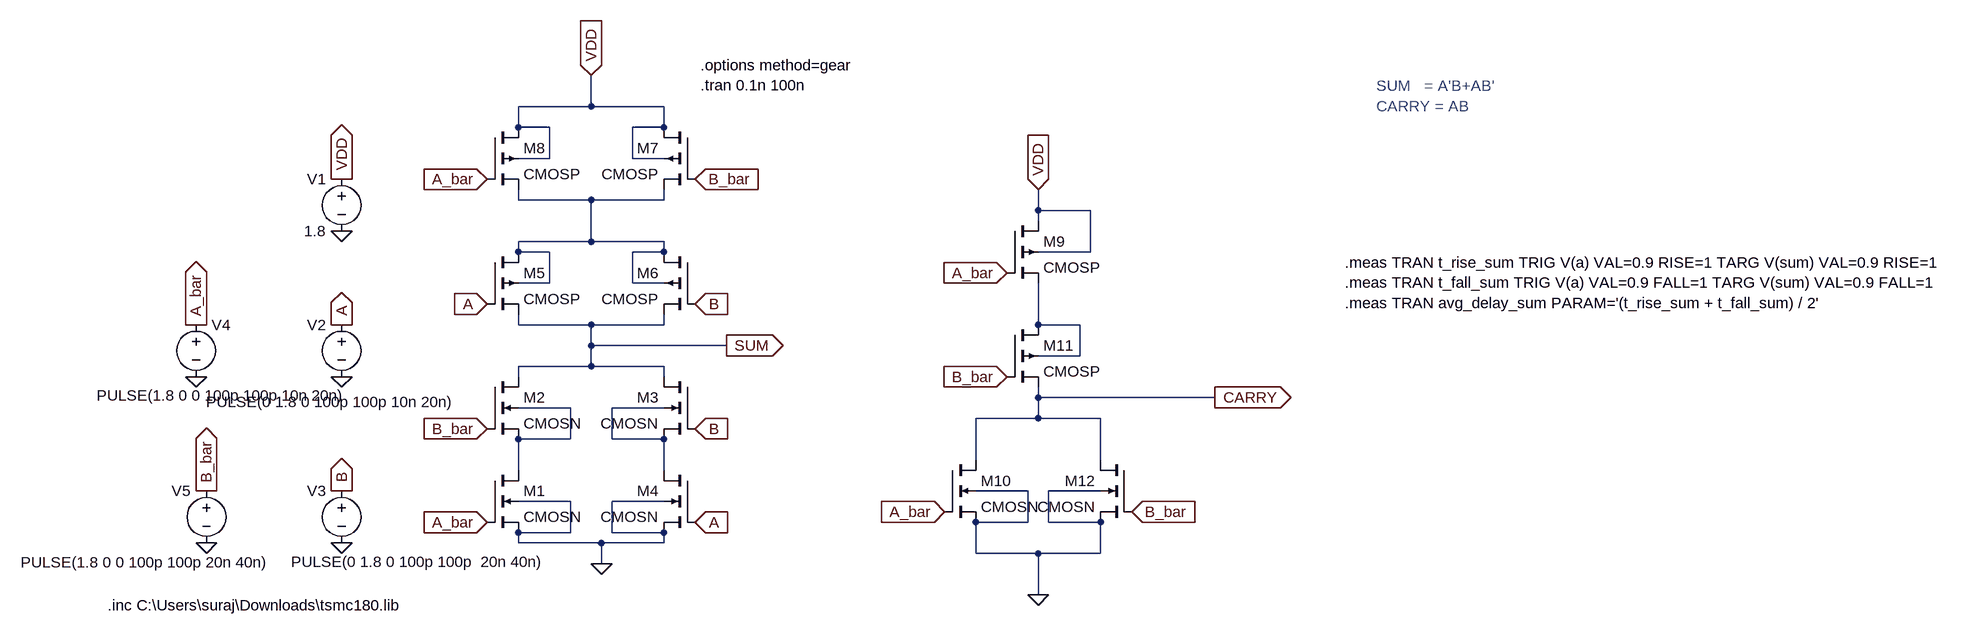
[diagram p0: schematic CMOS_haldAdder.asc]
CMOS_haldAdder.asc, the LTspice schematic file:
Version 4
SHEET 1 1704 712
WIRE -192 -96 -192 -144
WIRE -192 -96 -304 -96
WIRE -80 -96 -192 -96
WIRE -304 -64 -304 -96
WIRE -256 -64 -304 -64
WIRE -80 -64 -80 -96
WIRE -80 -64 -128 -64
WIRE -256 -16 -256 -64
WIRE -256 -16 -304 -16
WIRE -128 -16 -128 -64
WIRE -80 -16 -128 -16
WIRE -304 48 -304 32
WIRE -192 48 -304 48
WIRE -80 48 -80 32
WIRE -80 48 -192 48
WIRE 496 64 496 32
WIRE 576 64 496 64
WIRE 496 80 496 64
WIRE -192 112 -192 48
WIRE -192 112 -304 112
WIRE -80 112 -192 112
WIRE -304 128 -304 112
WIRE -256 128 -304 128
WIRE -80 128 -80 112
WIRE -80 128 -128 128
WIRE 576 128 576 64
WIRE 576 128 496 128
WIRE -256 176 -256 128
WIRE -256 176 -304 176
WIRE -128 176 -128 128
WIRE -80 176 -128 176
WIRE -304 240 -304 224
WIRE -192 240 -304 240
WIRE -80 240 -80 224
WIRE -80 240 -192 240
WIRE 496 240 496 176
WIRE 560 240 496 240
WIRE -192 272 -192 240
WIRE 16 272 -192 272
WIRE 560 288 560 240
WIRE 560 288 496 288
WIRE -192 304 -192 272
WIRE -192 304 -304 304
WIRE -80 304 -192 304
WIRE -304 320 -304 304
WIRE -80 320 -80 304
WIRE 496 352 496 336
WIRE 768 352 496 352
WIRE -224 368 -304 368
WIRE -80 368 -160 368
WIRE 496 384 496 352
WIRE 496 384 400 384
WIRE 592 384 496 384
WIRE -224 416 -224 368
WIRE -224 416 -304 416
WIRE -160 416 -160 368
WIRE -80 416 -160 416
WIRE 400 448 400 384
WIRE 592 448 592 384
WIRE -304 464 -304 416
WIRE -80 464 -80 416
WIRE 480 496 400 496
WIRE 592 496 512 496
WIRE -224 512 -304 512
WIRE -80 512 -160 512
WIRE 480 544 480 496
WIRE 480 544 400 544
WIRE 512 544 512 496
WIRE 592 544 512 544
WIRE -224 560 -224 512
WIRE -224 560 -304 560
WIRE -160 560 -160 512
WIRE -80 560 -160 560
WIRE -304 576 -304 560
WIRE -176 576 -304 576
WIRE -80 576 -80 560
WIRE -80 576 -176 576
WIRE 400 592 400 544
WIRE 496 592 400 592
WIRE 592 592 592 544
WIRE 592 592 496 592
WIRE -176 608 -176 576
WIRE 496 656 496 592
FLAG -176 608 0
FLAG -352 400 B_bar
IOPIN -352 400 In
FLAG -352 544 A_bar
IOPIN -352 544 In
FLAG -32 400 B
IOPIN -32 400 In
FLAG -32 544 A
IOPIN -32 544 In
FLAG -352 208 A
IOPIN -352 208 In
FLAG -352 16 A_bar
IOPIN -352 16 In
FLAG -32 16 B_bar
IOPIN -32 16 In
FLAG -32 208 B
IOPIN -32 208 In
FLAG 16 272 SUM
IOPIN 16 272 Out
FLAG -192 -144 VDD
IOPIN -192 -144 In
FLAG 448 160 A_bar
IOPIN 448 160 In
FLAG 352 528 A_bar
IOPIN 352 528 In
FLAG -576 96 0
FLAG -576 16 VDD
IOPIN -576 16 Out
FLAG -576 576 0
FLAG -576 320 0
FLAG -576 496 B
IOPIN -576 496 Out
FLAG -576 240 A
IOPIN -576 240 Out
FLAG -784 576 0
FLAG -784 496 B_bar
IOPIN -784 496 Out
FLAG -800 320 0
FLAG -800 240 A_bar
IOPIN -800 240 Out
FLAG 640 528 B_bar
IOPIN 640 528 In
FLAG 448 320 B_bar
IOPIN 448 320 In
FLAG 496 656 0
FLAG 496 32 VDD
IOPIN 496 32 In
FLAG 768 352 CARRY
IOPIN 768 352 Out
SYMBOL nmos4 -352 464 R0
SYMATTR InstName M1
SYMATTR Value CMOSN
SYMATTR Value2 l=0.18u w=360n
SYMBOL nmos4 -352 320 R0
SYMATTR InstName M2
SYMATTR Value CMOSN
SYMATTR Value2 l=0.18u w=360n
SYMBOL nmos4 -32 320 M0
SYMATTR InstName M3
SYMATTR Value CMOSN
SYMATTR Value2 l=0.18u w=360n
SYMBOL nmos4 -32 464 M0
SYMATTR InstName M4
SYMATTR Value CMOSN
SYMATTR Value2 l=0.18u w=360n
SYMBOL pmos4 -352 128 R0
SYMATTR InstName M5
SYMATTR Value CMOSP
SYMATTR Value2 l=0.18u w=720n
SYMBOL pmos4 -32 128 M0
SYMATTR InstName M6
SYMATTR Value CMOSP
SYMATTR Value2 l=0.18u w=720n
SYMBOL pmos4 -352 -64 R0
SYMATTR InstName M8
SYMATTR Value CMOSP
SYMATTR Value2 l=0.18u w= 720n
SYMBOL pmos4 -32 -64 M0
SYMATTR InstName M7
SYMATTR Value CMOSP
SYMATTR Value2 l=0.18u w=720n
SYMBOL pmos4 448 80 R0
SYMATTR InstName M9
SYMATTR Value CMOSP
SYMATTR Value2 l=0.18u w=4u
SYMBOL voltage -576 0 M0
WINDOW 123 0 0 Left 0
WINDOW 39 0 0 Left 0
SYMATTR InstName V1
SYMATTR Value 1.8
SYMBOL voltage -576 224 M0
WINDOW 3 -176 135 Left 2
WINDOW 123 0 0 Left 0
WINDOW 39 0 0 Left 0
SYMATTR Value PULSE(0 1.8 0 100p 100p 10n 20n)
SYMATTR InstName V2
SYMBOL voltage -576 480 M0
WINDOW 3 78 125 Right 2
WINDOW 123 0 0 Left 0
WINDOW 39 0 0 Left 0
SYMATTR Value PULSE(0 1.8 0 100p 100p  20n 40n)
SYMATTR InstName V3
SYMBOL voltage -784 480 M0
WINDOW 3 -99 126 Left 2
WINDOW 123 0 0 Left 0
WINDOW 39 0 0 Left 0
SYMATTR Value PULSE(1.8 0 0 100p 100p 20n 40n)
SYMATTR InstName V5
SYMBOL voltage -800 224 R0
WINDOW 3 -153 125 Left 2
WINDOW 123 0 0 Left 0
WINDOW 39 0 0 Left 0
SYMATTR Value PULSE(1.8 0 0 100p 100p 10n 20n)
SYMATTR InstName V4
SYMBOL pmos4 448 240 R0
SYMATTR InstName M11
SYMATTR Value CMOSP
SYMATTR Value2 l=0.18u w=4u
SYMBOL nmos4 352 448 R0
SYMATTR InstName M10
SYMATTR Value CMOSN
SYMATTR Value2 l=0.18u w=1u
SYMBOL nmos4 640 448 M0
SYMATTR InstName M12
SYMATTR Value CMOSN
SYMATTR Value2 l=0.18u w=1u
TEXT 1016 -128 Left 2 ;SUM   = A'B+AB'\nCARRY = AB
TEXT -936 672 Left 2 !.inc C:\\Users\\suraj\\Downloads\\tsmc180.lib
TEXT -24 -160 Left 2 !.options method=gear\n.tran 0.1n 100n
TEXT 968 144 Left 2 !.meas TRAN t_rise_sum TRIG V(a) VAL=0.9 RISE=1 TARG V(sum) VAL=0.9 RISE=1\n.meas TRAN t_fall_sum TRIG V(a) VAL=0.9 FALL=1 TARG V(sum) VAL=0.9 FALL=1\n.meas TRAN avg_delay_sum PARAM='(t_rise_sum + t_fall_sum) / 2'

The netlist it stands for:
* CMOS_haldAdder.asc
M1 N003 A_bar 0 0 CMOSN l=0.18u w=360n
M2 SUM B_bar N003 N003 CMOSN l=0.18u w=360n
M3 SUM B N004 N004 CMOSN l=0.18u w=360n
M4 N004 A 0 0 CMOSN l=0.18u w=360n
M5 N001 A SUM N001 CMOSP l=0.18u w=720n
M6 N001 B SUM N001 CMOSP l=0.18u w=720n
M8 VDD A_bar N001 VDD CMOSP l=0.18u w= 720n
M7 VDD B_bar N001 VDD CMOSP l=0.18u w=720n
M9 VDD A_bar N002 VDD CMOSP l=0.18u w=4u
V1 VDD 0 1.8
V2 A 0 PULSE(0 1.8 0 100p 100p 10n 20n)
V3 B 0 PULSE(0 1.8 0 100p 100p  20n 40n)
V5 B_bar 0 PULSE(1.8 0 0 100p 100p 20n 40n)
V4 A_bar 0 PULSE(1.8 0 0 100p 100p 10n 20n)
M11 N002 B_bar CARRY N002 CMOSP l=0.18u w=4u
M10 CARRY A_bar 0 0 CMOSN l=0.18u w=1u
M12 CARRY B_bar 0 0 CMOSN l=0.18u w=1u
.model NMOS NMOS
.model PMOS PMOS
.lib standard.mos
* SUM   = A'B+AB'
* CARRY = AB
.inc C:\Users\suraj\Downloads\tsmc180.lib
.options method=gear
.tran 0.1n 100n
.meas TRAN t_rise_sum TRIG V(a) VAL=0.9 RISE=1 TARG V(sum) VAL=0.9 RISE=1
.meas TRAN t_fall_sum TRIG V(a) VAL=0.9 FALL=1 TARG V(sum) VAL=0.9 FALL=1
.meas TRAN avg_delay_sum PARAM='(t_rise_sum + t_fall_sum) / 2'
.backanno
.end